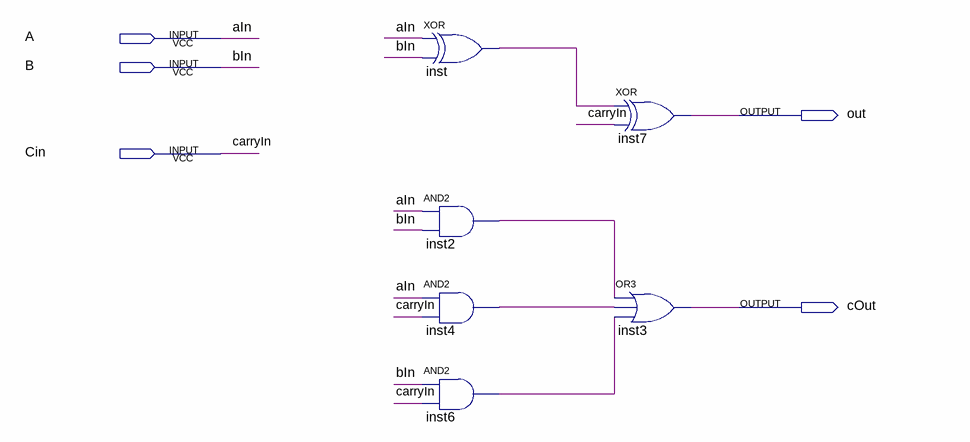
[diagram p0: schematic sheet]
// Quartus schematic fullAdder.bdf as structural Verilog: 6 symbols, 5 pins
module fullAdder (
  input  A,
  input  B,
  input  Cin,
  output out,
  output cOut
);

  wire inst2_out, inst4_out, inst6_out, inst_out;

  xor inst (inst_out, A, B);
  and inst2 (inst2_out, A, B);
  and inst4 (inst4_out, A, Cin);
  and inst6 (inst6_out, B, Cin);
  xor inst7 (out, inst_out, Cin);
  or inst3 (cOut, inst2_out, inst4_out, inst6_out);

  // Other names for the same wires on the sheet: aIn = A; bIn = B; carryIn = Cin
endmodule
